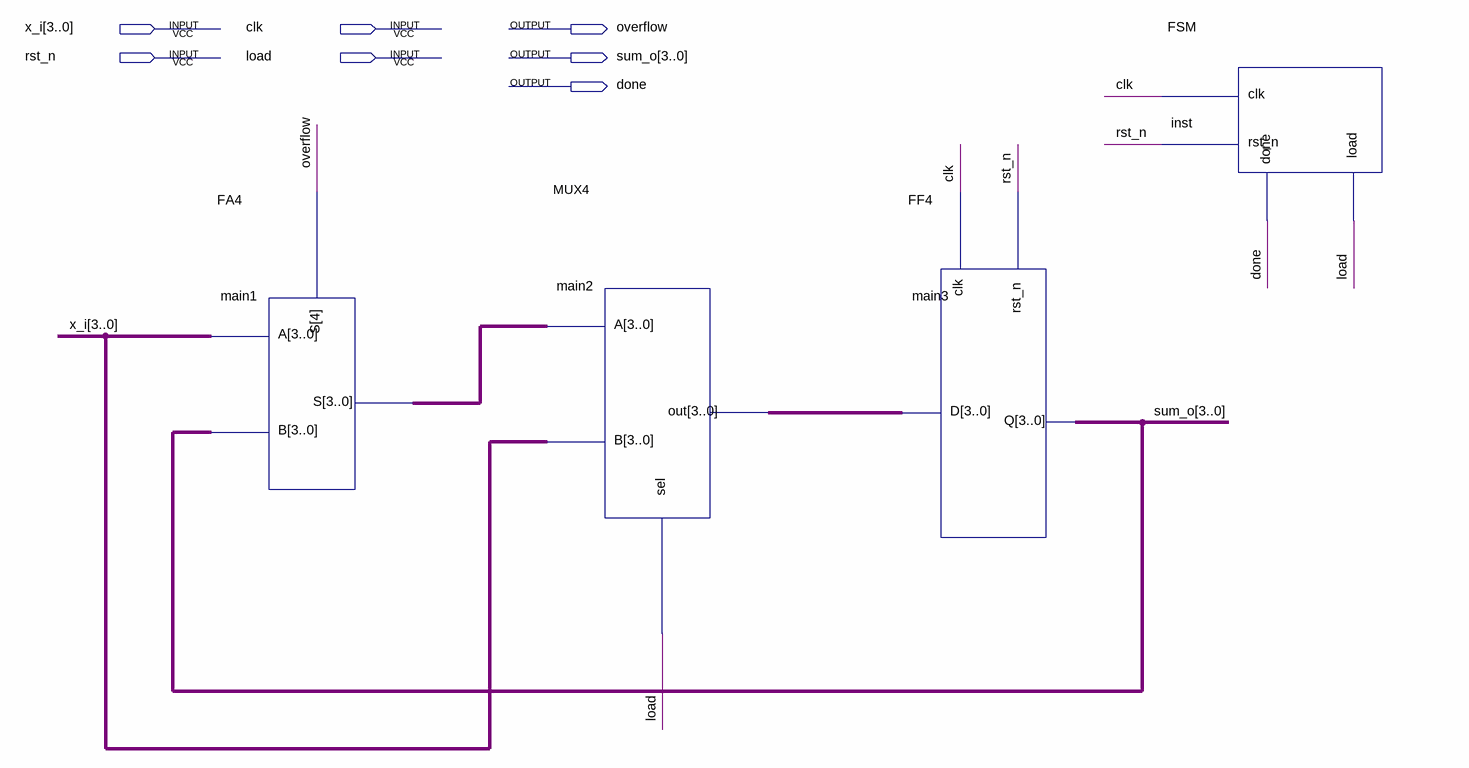
[diagram p0: schematic sheet]
// Quartus schematic AC4.bdf as structural Verilog: 4 symbols, 7 pins
module AC4 (
  input  [3:0] x_i,
  input  clk,
  input  rst_n,
  input  load,
  output overflow,
  output [3:0] sum_o,
  output done
);

  wire [3:0] main1_s, main2_out;

  FA4 main1 (.A(x_i), .B(sum_o), .S({overflow, main1_s}));
  MUX4 main2 (.A(main1_s), .B(x_i), .sel(load), .out(main2_out));
  FF4 main3 (.clk(clk), .rst_n(rst_n), .D(main2_out), .Q(sum_o));
  FSM inst (.load(load), .clk(clk), .rst_n(rst_n), .done(done));
endmodule
